# Altium schematic sheet Power.SchDoc
size Letter; DocumentNumber: 8; SheetNumber: 8; SheetTotal: 8
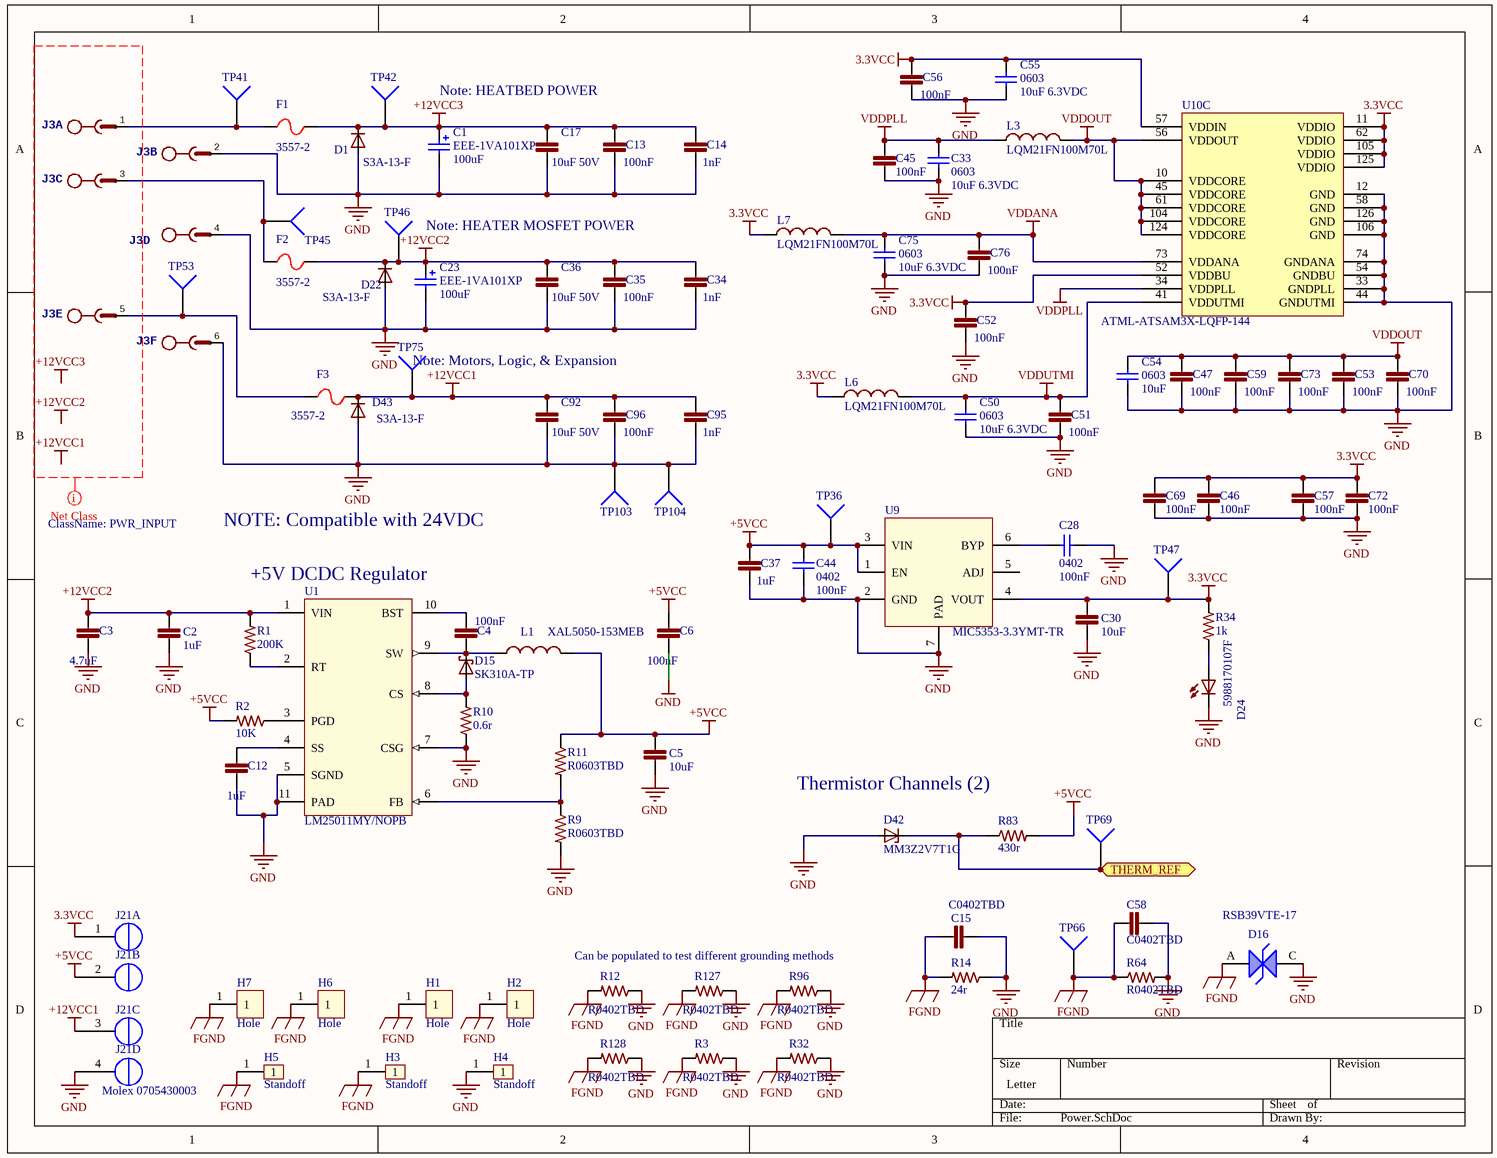
[diagram p0: Power.SchDoc]

## Parts
C1  EEE-1VA101XP  value 100uF  [EEE-1VA101XP]
C2  1uF  [C0805]
C3  4.7uF  [C1206]
C4  100nF  [C0603]
C5  10uF  [C0805]
C6  100nF  [C0402]
C12  1uF  [C0402]
C13  100nF  [C0603]
C14  1nF  [C0603]
C15  C0402TBD  [C0402]
C17  10uF 50V  [C1206]
C23  EEE-1VA101XP  value 100uF  [EEE-1VA101XP]
C28  value 100nF  [C0402]  (hidden comment: 0402)
C30  10uF  [C0805]
C33  0603  value 10uF 6.3VDC  [C0603]
C34  1nF  [C0603]
C35  100nF  [C0603]
C36  10uF 50V  [C1206]
C37  1uF  [C0402]
C44  value 100nF  [C0402]  (hidden comment: 0402)
C45  100nF  [C0402]
C46  100nF  [C0402]
C47  100nF  [C0402]
C50  0603  value 10uF 6.3VDC  [C0603]
C51  100nF  [C0402]
C52  100nF  [C0402]
C53  100nF  [C0402]
C54  0603  value 10uF  [C0603]
C55  0603  value 10uF 6.3VDC  [C0603]
C56  100nF  [C0402]
C57  100nF  [C0402]
C58  C0402TBD  [C0402]
C59  100nF  [C0402]
C69  100nF  [C0402]
C70  100nF  [C0402]
C72  100nF  [C0402]
C73  100nF  [C0402]
C75  0603  value 10uF 6.3VDC  [C0603]
C76  100nF  [C0402]
C92  10uF 50V  [C1206]
C95  1nF  [C0603]
C96  100nF  [C0603]
D1  S3A-13-F  [DO-214AB]
D15  SK310A-TP  [SMA-SM]
D16  RSB39VTE-17  [SOD323-R]
D22  S3A-13-F  [DO-214AB]
D24  5988170107F  [LED2012120]
D42  MM3Z2V7T1G  [SOD323-R]
D43  S3A-13-F  [DO-214AB]
F1  3557-2  [3557]
F2  3557-2  [3557]
F3  3557-2  [3557]
H1  Hole  [Wave_hole_3x7-singleSided]  (no BOM)
H2  Hole  [Wave_hole_3x7-singleSided]  (no BOM)
H3  Standoff  [Standoff3mmTopConn]  (no BOM)
H4  Standoff  [Standoff3mmTopConn]  (no BOM)
H5  Standoff  [Standoff3mmTopConn]  (no BOM)
H6  Hole  [Wave_hole_3x7-singleSided]  (no BOM)
H7  Hole  [Wave_hole_3x7-singleSided]  (no BOM)
J3  MSTBV6  [MSTBV6]  (value not drawn)  (parts A,B,C,D,E,F of 6)
J21  Molex 0705430003  [4POL254]  (parts A,B,C,D of 4)
L1  XAL5050-153MEB  [XAL50xx-153]
L3  LQM21FN100M70L  [C0805]
L6  LQM21FN100M70L  [C0805]
L7  LQM21FN100M70L  [C0805]
R1  200K  [R0402]
R2  10K  [R0402]
R3  R0402TBD  [R0402]
R9  R0603TBD  [R0603]
R10  0.6r  [2512R-0.55]
R11  R0603TBD  [R0603]
R12  R0402TBD  [R0402]
R14  24r  [R0402]
R32  R0402TBD  [R0402]
R34  1k  [R0402]
R64  R0402TBD  [R0402]
R83  430r  [R0603]
R96  R0402TBD  [R0402]
R127  R0402TBD  [R0402]
R128  R0402TBD  [R0402]
TP36  TP4  [TP-2]  (value not drawn)
TP41  TP4  [TP-2]  (value not drawn)
TP42  TP4  [TP-2]  (value not drawn)
TP45  TP4  [TP-2]  (value not drawn)
TP46  TP4  [TP-2]  (value not drawn)
TP47  TP4  [TP-2]  (value not drawn)
TP53  TP4  [TP-2]  (value not drawn)
TP66  TP4  [TP-2]  (value not drawn)
TP69  TP4  [TP-2]  (value not drawn)
TP75  TP4  [TP-2]  (value not drawn)
TP103  TP4  [TP-2]  (value not drawn)
TP104  TP4  [TP-2]  (value not drawn)
U1  LM25011MY/NOPB  [VSSOP10]
U9  MIC5353-3.3YMT-TR  [TDFN1616-6LD-PL-1]
U10  ATML-ATSAM3X-LQFP-144  [LQFP144_N]  (part C of 3)

## Ports
THERM_REF

## Nets
3.3VCC: C30.1 C46.1 C52.1 C55.2 C56.1 C57.1 C69.1 C72.1 J21.1(OUT2B) L6.1 L7.1 R34.2 TP47.1 U9.4(VOUT) U10.11(VDDIO) U10.52(VDDBU) U10.57(VDDIN) U10.62(VDDIO) U10.105(VDDIO) U10.125(VDDIO)
+5VCC: C5.1 C6.2 C37.1 C44.1 J21.2(OUT2A) L1.2 R2.2 R11.1 R83.2 TP36.1 U9.1(EN) U9.3(VIN)
+12VCC1: C92.1 C95.1 C96.1 D43.C F3.2 J21.3(OUT1A) TP75.1
+12VCC2: C2.1 C3.1 C23.1 C34.1 C35.1 C36.1 D22.C F2.2 R1.2 TP46.1 U1.1(VIN)
+12VCC3: C1.1 C13.1 C14.1 C17.1 D1.C F1.2 TP42.1
FGND: C15.1 C58.1 D16.A H1.1 H2.1 H3.1 H5.1 H6.1 H7.1 R3.2 R12.2 R14.2 R32.2 R64.1 R96.2 R127.2 R128.2 TP66.1
GND: C1.2 C2.2 C3.2 C5.2 C6.1 C12.2 C13.2 C14.2 C15.2 C17.2 C23.2 C28.2 C30.2 C33.1 C34.2 C35.2 C36.2 C37.2 C44.2 C45.2 C46.2 C47.2 C50.1 C51.2 C52.2 C53.2 C54.1 C55.1 C56.2 C57.2 C58.2 C59.2 C69.2 C70.2 C72.2 C73.2 C75.1 C76.2 C92.2 C95.2 C96.2 D1.A D16.C D22.A D24.C D42.A D43.A H4.1 J3.2 J3.4 J3.6 J21.4(OUT1B) R3.1 R9.2 R10.1 R12.1 R14.1 R32.1 R64.2 R96.1 R127.1 R128.1 TP103.1 TP104.1 U1.5(SGND) U1.7(CSG) U1.11(PAD) U9.2(GND) U9.7(PAD) U10.12(GND) U10.33(GNDPLL) U10.44(GNDUTMI) U10.54(GNDBU) U10.58(GND) U10.74(GNDANA) U10.106(GND) U10.126(GND)
VDDANA: C75.2 C76.1 L7.2 U10.73(VDDANA)
VDDOUT: C47.1 C53.1 C54.2 C59.1 C70.1 C73.1 L3.1 U10.10(VDDCORE) U10.45(VDDCORE) U10.56(VDDOUT) U10.61(VDDCORE) U10.104(VDDCORE) U10.124(VDDCORE)
VDDPLL: C33.2 C45.1 L3.2 U10.34(VDDPLL)
VDDUTMI: C50.2 C51.1 L6.2 U10.41(VDDUTMI)
THERM_REF: D42.C R83.1 TP69.1 ; port THERM_REF
NetC4_1: C4.1 U1.10(BST)
NetC4_2: C4.2 D15.C L1.1 U1.9(SW)
NetC12_1: C12.1 U1.4(SS)
NetC28_1: C28.1 U9.6(BYP)
NetD15_A: D15.A R10.2 U1.8(CS)
NetD24_A: D24.A R34.1
NetF1_1: F1.1 J3.1 TP41.1
NetF2_1: F2.1 J3.3 TP45.1
NetF3_1: F3.1 J3.5 TP53.1
NetR1_1: R1.1 U1.2(RT)
NetR2_1: R2.1 U1.3(PGD)
NetR9_1: R9.1 R11.2 U1.6(FB)

Not connected (* = marked no-connect by the designer): U9 5(ADJ)

## Layout directives
net class PWR_INPUT: +12VCC1, +12VCC2, +12VCC3

## Notes on the sheet
- Note: HEATBED POWER
- Note: HEATER MOSFET POWER
- (near TP75) Note: Motors, Logic, & Expansion
- NOTE: Compatible with 24VDC
- +5V DCDC Regulator
- Thermistor Channels (2)
- Can be populated to test different grounding methods
- Labels drawn without touching a wire or pin: +12VCC1, +12VCC2, +12VCC3

## Library data of the parts
C1 C23 = EEE-1VA101XP: CAP ALUM 100UF 35V 20% SMD; Manufacture: Panasonic; Digikey Part #: PCE3951CT-ND; Price: $0.63; Mount Type: SMT Panasonic VS D Series; Status: Active; Height: 7.70mm; Datasheet: http://industrial.panasonic.com/www-cgi/jvcr13pz.cgi?E+PZ+3+ABA0002+EEE1VA101XP+7+WW; Manufacture Part #: EEE-1VA101XP
C2 = GRM21BR71H105KA12L: CAP CER 0805 1uF 50V 10% X7R; LastRevisionNote: ImportComponents; Published: 23-Apr-2014; Publisher: UltiMachine; LastRevisionDate: 23-Apr-2014; ManufacturerPartNumber: GRM21BR71H105KA12L; VALUE: 1uF
C3 = C1206C475K5PACTU: CAP CER 1206 4.7uF 50V 10% X5R; LastRevisionNote: ImportComponents; Published: 23-Apr-2014; Publisher: UltiMachine; LastRevisionDate: 23-Apr-2014; ManufacturerPartNumber: C1206C475K5PACTU; VALUE: 4.7uF
C4 C13 C35 C96 = C0603C104K5RACTU: CAP CER 0603 100nF 50V 10% X7R; LastRevisionNote: ImportComponents; Published: 23-Apr-2014; Publisher: UltiMachine; LastRevisionDate: 23-Apr-2014; ManufacturerPartNumber: C0603C104K5RACTU; VALUE: 100nF
C5 C30 = C0805C106K8PACTU: CAP CER 0805 10uF 10V 10% X5R; LastRevisionNote: ImportComponents; Published: 23-Apr-2014; Publisher: UltiMachine; LastRevisionDate: 23-Apr-2014; ManufacturerPartNumber: C0805C106K8PACTU; VALUE: 10uF
C6 C45-C47 C51-C53 C56 C57 C59 C69 C70 C72 C73 C76 = GRM155R71C104KA88D: CAP CER 0402 100nF 16V 10% X7R; LastRevisionNote: ImportComponents; Published: 23-Apr-2014; Publisher: UltiMachine; VALUE: 100nF; LastRevisionDate: 23-Apr-2014; ManufacturerPartNumber: GRM155R71C104KA88D
C12 C37 = GRM155R60J105KE19D: CAP CER 0402 1uF 6.3V 10% X5R; LastRevisionNote: ImportComponents; Published: 23-Apr-2014; Publisher: UltiMachine; LastRevisionDate: 23-Apr-2014; ManufacturerPartNumber: GRM155R60J105KE19D; VALUE: 1uF
C14 C34 C95 = C0603C102K5RACTU: CAP CER 0603  1nF 50v 10% X7R; LastRevisionNote: ImportComponents; Published: 23-Apr-2014; Publisher: UltiMachine; VALUE: 1nF; LastRevisionDate: 23-Apr-2014; ManufacturerPartNumber: C0603C102K5RACTU
C15 C58 = C0402TBD: Capacitor Non Polarized; LastRevisionNote: ImportComponents; Published: 23-Apr-2014; Publisher: UltiMachine; VALUE: C0402TBD; LastRevisionDate: 23-Apr-2014
C17 C36 C92 = CL31A106KBHNNNE: CAP CER 10UF 50V 10% X5R 1206; Manufacturer: Samsung; LastRevisionNote: ImportComponents; Published: 25-mar-2015; Publisher: UltiMachine; LastRevisionDate: 25-mar-2015; ManufacturerPartNumber: CL31A106KBHNNNE; VALUE: 10uF 50V
C28 C44 = 100nF C0402 - GRM155R71C104KA88D: Capacitor (Semiconductor SIM Model); MFR: Murata; Part Description: CAP CER 0.1UF 16V 10% X7R 0402; Tolerance: 10%; Voltage: 16v; Published: 10 - Dec - 2014; LatestRevisionDate: 10 - Dec - 2014; LatestRevisionNote: Ultimachine Footprint Added; Publisher: Ultimachine; Component Type: Chip Capacitor; MFR Part #: GRM155R71C104KA88D; Mounting Type: SMT 0402; Datasheet: http://psearch.murata.com/capacitor/product/GRM155R71C104KA88%23.pdf; Height: 0.5 ±0.05mm; PackageReference: 0402
C33 C50 C54 C55 C75 = C1608JB0J106K080AB: CAP CER 10UF 6.3V 10% JB 0603; MFR: TDK; Voltage: 6.3VDC; Published: 10 - Dec - 2014; LatestRevisionDate: 10 - Dec - 2014; Component Type: Chip Capacitor; MFR Part #: C1608JB0J106K080AB; Part Description: CAP CER 10UF 6.3V 10% JB 0603; Mounting Type: SMT 0603; Datasheet: http://www.tdk.com/pdf/TDKMLCCCapRange.pdf; Height: 0.9mm; Tolerance: 10%; Digikey #: 445-11185-1-ND; PackageReference: 0402
D1 D22 D43 = S3A-13-F: DIODE DO-214AB; LastRevisionNote: ImportComponents; Published: 23-Apr-2014; Publisher: UltiMachine; LastRevisionDate: 23-Apr-2014; Value: S3A-13-F
D15 = SK310A: DIODE Schottky 3A SMA; LastRevisionNote: ImportComponents; LastRevisionDate: 23-Apr-2014; ManufacturerPartNumber: SK310A; Published: 23-Apr-2014; Publisher: UltiMachine
D16 = RSB39VTE-17: DIODE TVS
D24 = 5988170107F: LED 0805 Green; LastRevisionNote: ImportComponents; Published: 23-Apr-2014; Publisher: UltiMachine; LastRevisionDate: 23-Apr-2014; VALUE: 5988170107F
D42 = MM3Z2V7T1G: Z-Diode 2.7V 10mA 200mW; LastRevisionNote: ImportComponents; Published: 23-Apr-2014; Publisher: UltiMachine; LastRevisionDate: 23-Apr-2014
F1-F3 = 3557-2: FUSE PTH ATO; LastRevisionNote: ImportComponents; Published: 23-Apr-2014; Publisher: UltiMachine; LastRevisionDate: 23-Apr-2014; ManufacturerPartNumber: 3557-2
H3-H5 = Standoff3TopConn: Mechanical - Top connect
J3 = MSTBV6: PHOENIX; LastRevisionNote: ImportComponents; Published: 23-Apr-2014; Publisher: UltiMachine; LastRevisionDate: 23-Apr-2014
J21 = Molex 0705430003 Alt: Molex 4 Pin Clip Connector
L1 = XAL5050-153MEB: IND 15uH 3.9A 20%; LastRevisionNote: ImportComponents; Published: 23-Apr-2014; Publisher: UltiMachine; LastRevisionDate: 23-Apr-2014; ManufacturerPartNumber: XAL5050-153MEB; Value: XAL5050-153MEB
L3 L6 L7 = LQM21FN100M70L: IND 0805 10uH 100mA 780 mOhm 20%; ManufacturerPartNumber: CBC2012T100M; LastRevisionNote: ImportComponents; Published: 23-Apr-2014; Publisher: UltiMachine; LastRevisionDate: 23-Apr-2014; Value: LQM21FN100M70L
R1 = CRCW0402200KFKED: RES 0402 200k 63mW 1%; LastRevisionNote: ImportComponents; Published: 23-Apr-2014; Publisher: UltiMachine; LastRevisionDate: 23-Apr-2014; ManufacturerPartNumber: CRCW0402200KFKED; VALUE: 200K
R2 = RC0402FR-0710KP: RES SMD 10K OHM 1% 1/16W 0402; LastRevisionNote: ImportComponents; Published: 23-Apr-2014; Publisher: UltiMachine; LastRevisionDate: 23-Apr-2014; ManufacturerPartNumber: RC0402FR-0710KP; VALUE: 10K
R3 R12 R32 R64 R96 R127 R128 = R0402TBD: Resistor; LastRevisionNote: ImportComponents; Published: 23-Apr-2014; Publisher: UltiMachine; LastRevisionDate: 23-Apr-2014; VALUE: R0402TBD
R9 R11 = R0603TBD: Resistor; LastRevisionNote: ImportComponents; Published: 23-Apr-2014; Publisher: UltiMachine; LastRevisionDate: 23-Apr-2014; VALUE: R0603TBD
R10 = RL2512FK-070R06L: RES 0.06 OHM 1W 1% 2512 SMD; LastRevisionNote: ImportComponents; Published: 23-Apr-2014; Publisher: UltiMachine; LastRevisionDate: 23-Apr-2014; ManufacturerPartNumber: RL2512FK-070R06L; VALUE: 0.6r
R14 = CRCW040224R0FKED: Res Thick Film 0402 24 Ohm 1% 0.063W; ManufacturerPartNumber: CRCW0402200KFKED; LastRevisionNote: ImportComponents; Published: 23-Apr-2014; Publisher: UltiMachine; LastRevisionDate: 23-Apr-2014; VALUE: 24r
R34 = RK73H1ETTP1001F: RES 0402 1k 63mW 1%; LastRevisionNote: ImportComponents; Published: 23-Apr-2014; Publisher: UltiMachine; LastRevisionDate: 23-Apr-2014; VALUE: 1k
R83 = RC0603JR-07430RL: RES 0603 0.1 W 430 Ohms 5% ±100 ppm/°C SMT; LastRevisionNote: ImportComponents; Published: 23-Apr-2014; Publisher: UltiMachine; LastRevisionDate: 23-Apr-2014; ManufacturerPartNumber: RC0603JR-07430RL; VALUE: 430r
TP36 TP41 TP42 TP45-TP47 TP53 TP66 TP69 TP75 TP103 TP104 = Socket: LatestRevisionDate: 17-Jul-2002; LatestRevisionNote: Re-released for DXP Platform.; Publisher: Altium Limited
U1 = LM25011: REG BUCK; Value: LM25011MY/NOPB
U9 = MIC5353-3.3YMT-TR: LDO 3.3V 500mA - low ESR Cout